# EAGLE schematic CarteMereM1_V2 (EAGLE 8.4.0)

## Sheet 1 of 2
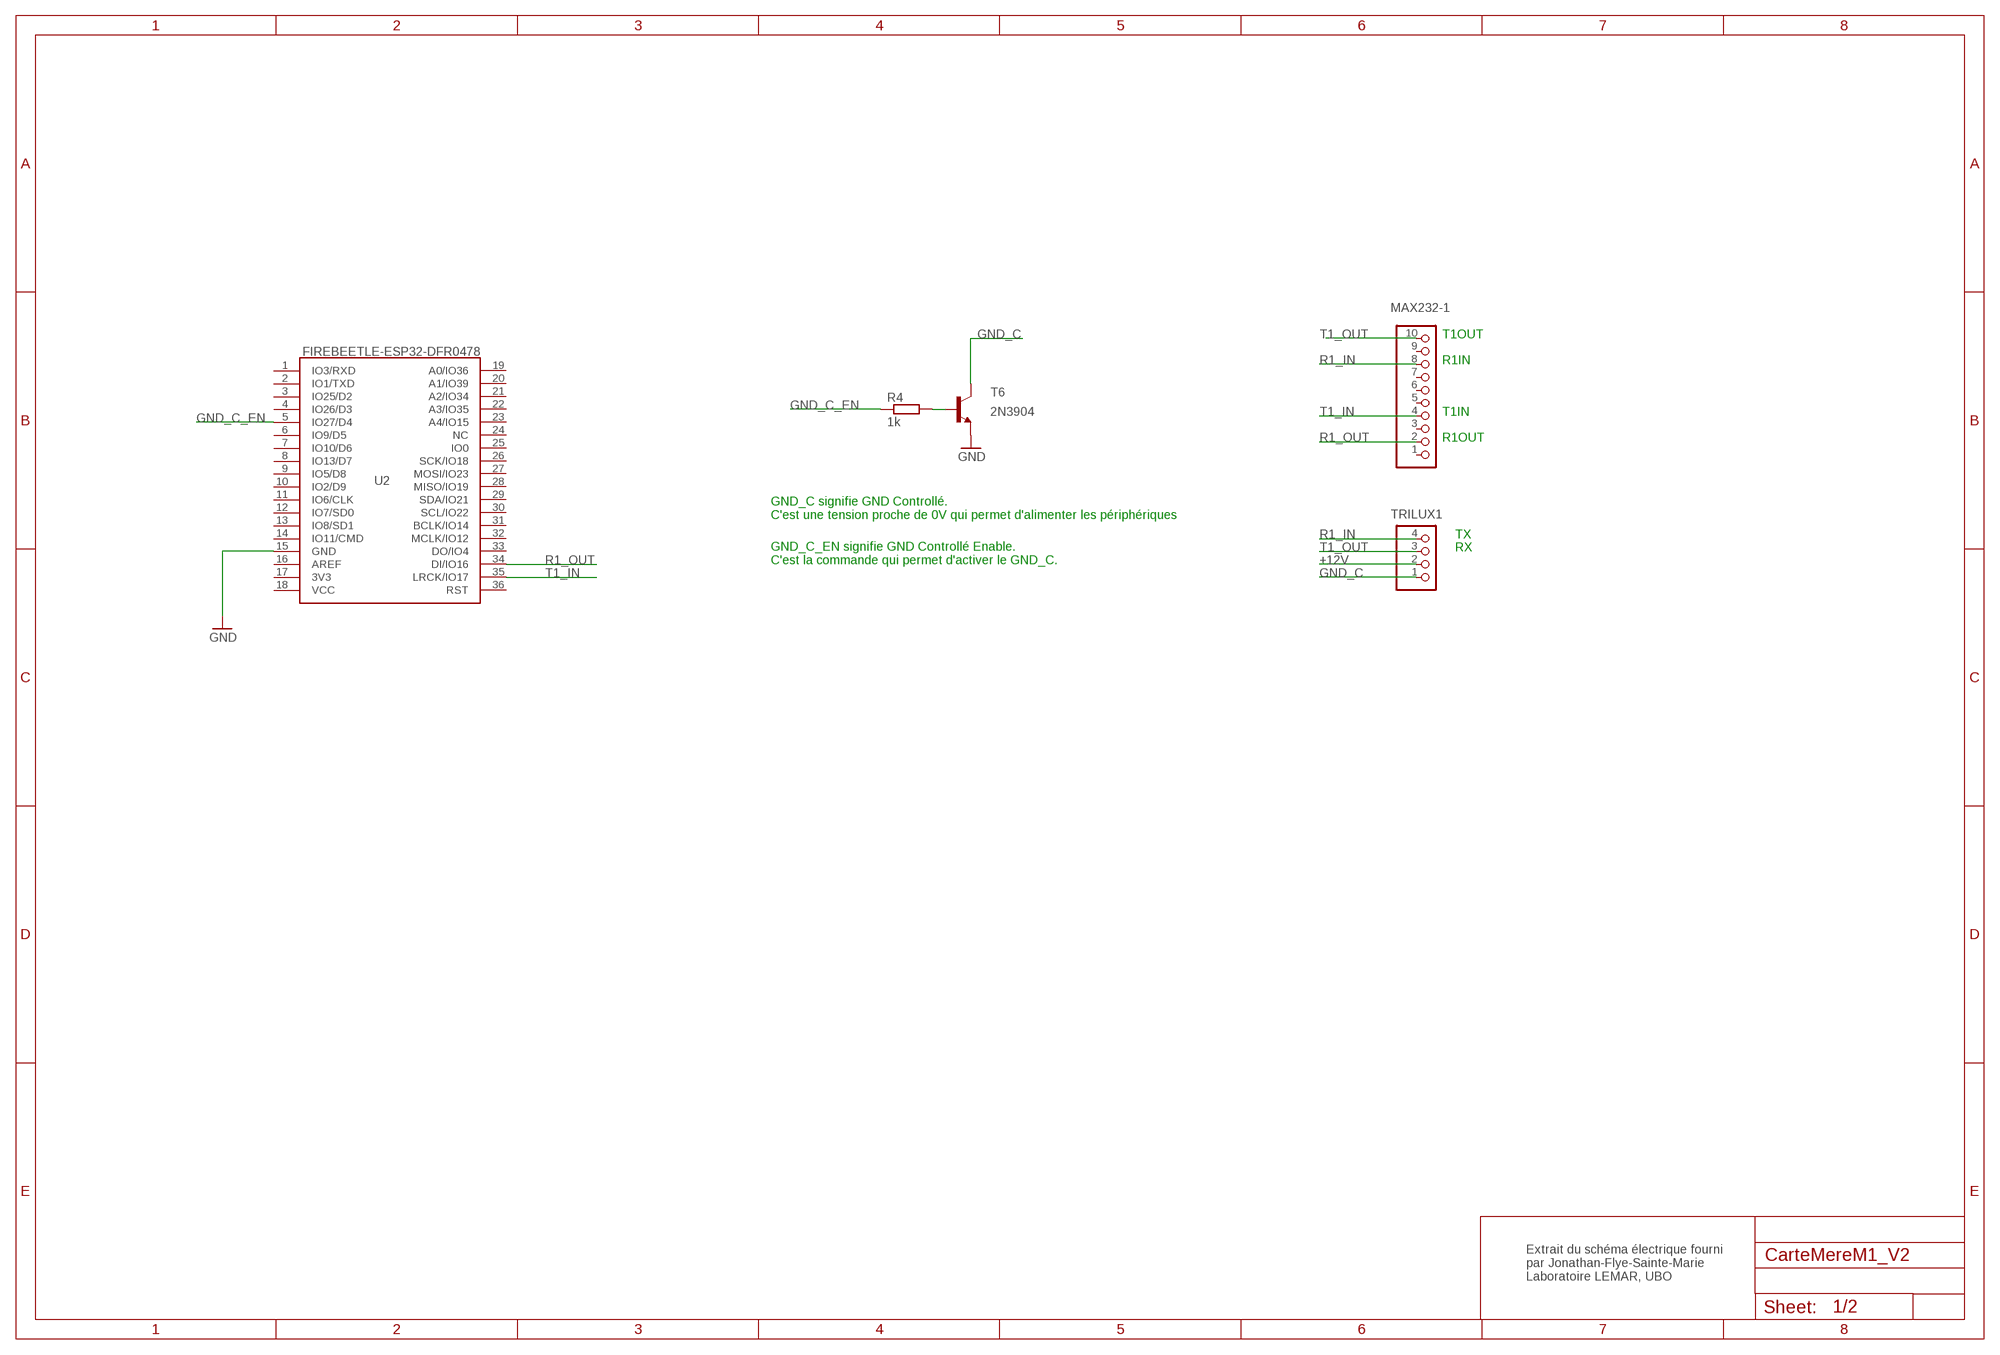
[diagram p0: schematic, sheet 1, part 1 of 2]
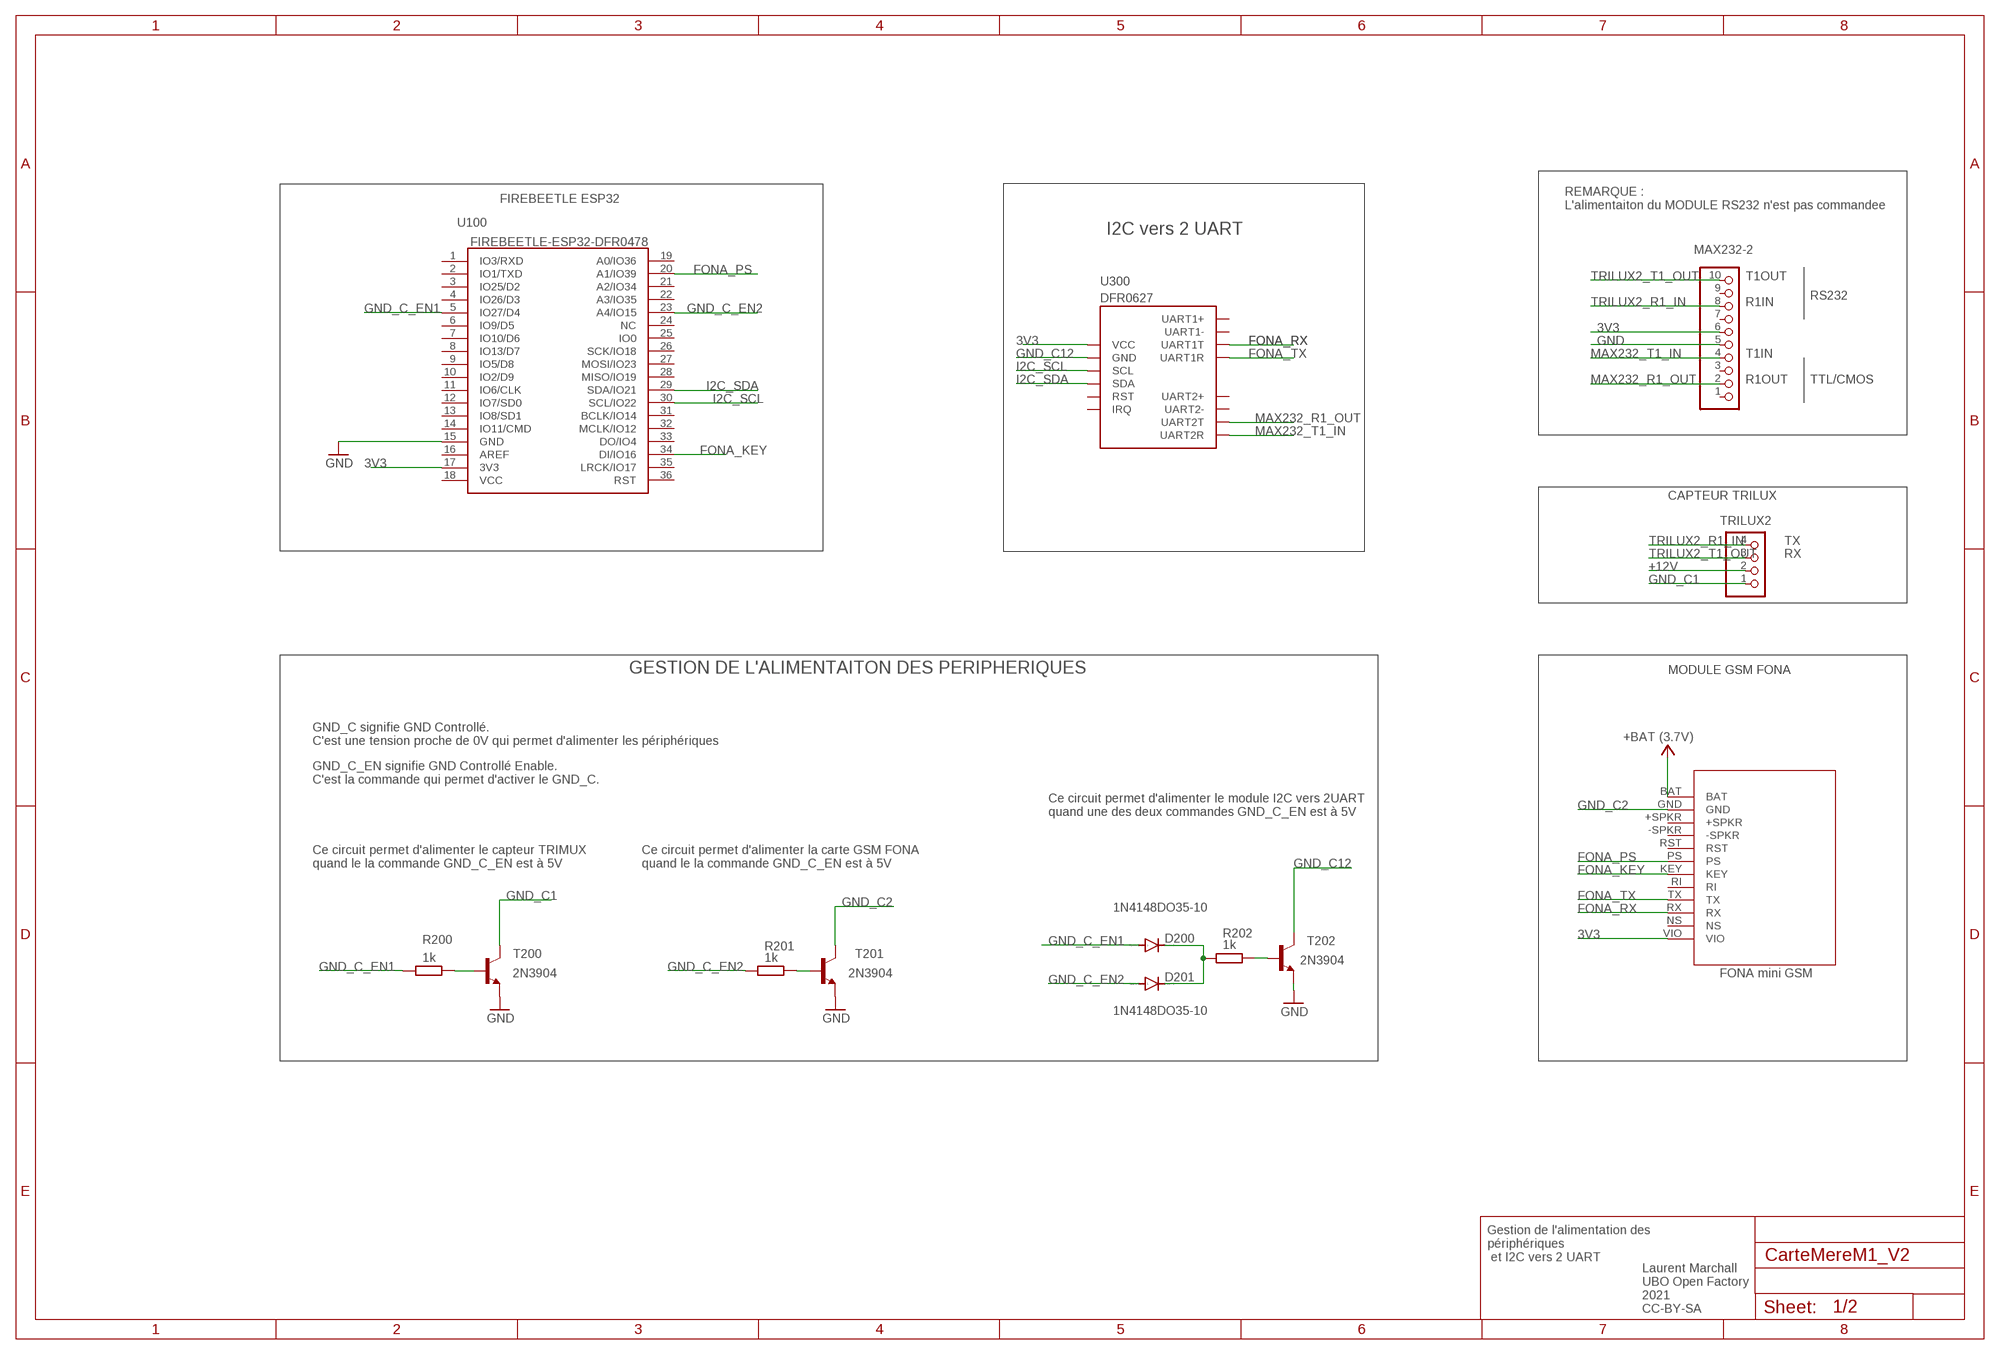
[diagram p1: schematic, sheet 1, part 2 of 2]

### Parts
D200  1N4148DO35-10  [DO35-10]
D201  1N4148DO35-10  [DO35-10]
MAX232-1  PINHD-1X10  [1X10]
MAX232-2  PINHD-1X10  [1X10]
R4  1k  R-EU_0204/7  [0204/7]
R200  1k  R-EU_0204/7  [0204/7]
R201  1k  R-EU_0204/7  [0204/7]
R202  1k  R-EU_0204/7  [0204/7]
T6  2N3904  [TO92]
T200  2N3904  [TO92]
T201  2N3904  [TO92]
T202  2N3904  [TO92]
TRILUX1  PINHD-1X4  [1X04]
TRILUX2  PINHD-1X4  [1X04]
U2  FIREBEETLE-ESP32-DFR0478  [FIREBEETLE_ESP32]
U100  FIREBEETLE-ESP32-DFR0478  [FIREBEETLE_ESP32]
U300  DFR0627  DUAL-UART-MODULE-DFR0627  [DUAL-UART-MODULE-DFR0627]
U$1  FONA_MINI_GSM  [FONA_MINI_GSM]

### Nets
3V3: MAX232-2.6 U100.17(3V3) U300.VCC U$1.VIO
+12V: TRILUX1.2 TRILUX2.2
FONA_KEY: U100.34(DI/IO16) U$1.KEY
FONA_PS: U100.20(A1/IO39) U$1.PS
FONA_RX: U300.UART1T U$1.RX
FONA_TX: U300.UART1R U$1.TX
GND: MAX232-2.5 T6.3(E) T200.3(E) T201.3(E) T202.3(E) U2.15(GND) U100.15(GND)
GND_C: T6.1(C) TRILUX1.1
GND_C1: T200.1(C) TRILUX2.1
GND_C2: T201.1(C) U$1.GND
GND_C12: T202.1(C) U300.GND
GND_C_EN: R4.1 U2.5(IO27/D4)
GND_C_EN1: D200.A R200.1 U100.5(IO27/D4)
GND_C_EN2: D201.A R201.1 U100.23(A4/IO15)
I2C_SCL: U100.30(SCL/IO22) U300.SCL
I2C_SDA: U100.29(SDA/IO21) U300.SDA
MAX232_R1_OUT: MAX232-2.2 U300.UART2T
MAX232_T1_IN: MAX232-2.4 U300.UART2R
N$3: R200.2 T200.2(B)
N$4: R201.2 T201.2(B)
N$5: R202.2 T202.2(B)
N$9: D200.C D201.C R202.1
N$23: R4.2 T6.2(B)
R1_IN: MAX232-1.8 TRILUX1.4
R1_OUT: MAX232-1.2 U2.34(DI/IO16)
T1_IN: MAX232-1.4 U2.35(LRCK/IO17)
T1_OUT: MAX232-1.10 TRILUX1.3
TRILUX2_R1_IN: MAX232-2.8 TRILUX2.4
TRILUX2_T1_OUT: MAX232-2.10 TRILUX2.3
VCC: U$1.BAT ; supply symbol labelled +BAT (3.7V)
Unconnected: MAX232-1.1 MAX232-1.3 MAX232-1.5 MAX232-1.6 MAX232-1.7 MAX232-1.9 MAX232-2.1 MAX232-2.3 MAX232-2.7 MAX232-2.9 U2.1(IO3/RXD) U2.2(IO1/TXD) U2.3(IO25/D2) U2.4(IO26/D3) U2.6(IO9/D5) U2.7(IO10/D6) U2.8(IO13/D7) U2.9(IO5/D8) U2.10(IO2/D9) U2.11(IO6/CLK) U2.12(IO7/SD0) U2.13(IO8/SD1) U2.14(IO11/CMD) U2.16(AREF) U2.17(3V3) U2.18(VCC) U2.19(A0/IO36) U2.20(A1/IO39) U2.21(A2/IO34) U2.22(A3/IO35) U2.23(A4/IO15) U2.24(NC) U2.25(IO0) U2.26(SCK/IO18) U2.27(MOSI/IO23) U2.28(MISO/IO19) U2.29(SDA/IO21) U2.30(SCL/IO22) U2.31(BCLK/IO14) U2.32(MCLK/IO12) U2.33(DO/IO4) U2.36(RST) U100.1(IO3/RXD) U100.2(IO1/TXD) U100.3(IO25/D2) U100.4(IO26/D3) U100.6(IO9/D5) U100.7(IO10/D6) U100.8(IO13/D7) U100.9(IO5/D8) U100.10(IO2/D9) U100.11(IO6/CLK) U100.12(IO7/SD0) U100.13(IO8/SD1) U100.14(IO11/CMD) U100.16(AREF) U100.18(VCC) U100.19(A0/IO36) U100.21(A2/IO34) U100.22(A3/IO35) U100.24(NC) U100.25(IO0) U100.26(SCK/IO18) U100.27(MOSI/IO23) U100.28(MISO/IO19) U100.31(BCLK/IO14) U100.32(MCLK/IO12) U100.33(DO/IO4) U100.35(LRCK/IO17) U100.36(RST) U300.IRQ U300.RST U300.UART1+ U300.UART1- U300.UART2+ U300.UART2- U$1.+SPKR U$1.-SPKR U$1.NS U$1.RI U$1.RST

### Notes on the sheet
- T1OUT
- R1IN
- T1IN
- R1OUT
- GND_C signifie GND Controllé.
  C'est une tension proche de 0V qui permet d'alimenter les périphériques
- TX
- RX
- GND_C_EN signifie GND Controllé Enable.
  C'est la commande qui permet d'activer le GND_C.
- Extrait du schéma électrique fourni 
  par Jonathan-Flye-Sainte-Marie
  Laboratoire LEMAR, UBO
- FIREBEETLE ESP32
- REMARQUE :
  L'alimentaiton du MODULE RS232 n'est pas commandee
- I2C vers 2 UART
- T1OUT
- RS232
- R1IN
- T1IN
- R1OUT | TTL/CMOS
- CAPTEUR TRILUX
- TX
- RX
- GESTION DE L'ALIMENTAITON DES PERIPHERIQUES | MODULE GSM FONA
- GND_C signifie GND Controllé.
  C'est une tension proche de 0V qui permet d'alimenter les périphériques
- GND_C_EN signifie GND Controllé Enable.
  C'est la commande qui permet d'activer le GND_C.
- Ce circuit permet d'alimenter le module I2C vers 2UART
  quand une des deux commandes GND_C_EN est à 5V
- Ce circuit permet d'alimenter le capteur TRIMUX 
  quand le la commande GND_C_EN est à 5V
- Ce circuit permet d'alimenter la carte GSM FONA
  quand le la commande GND_C_EN est à 5V
- Gestion de l'alimentation des 
  périphériques
   et I2C vers 2 UART
- Laurent Marchall
  UBO Open Factory
  2021
  CC-BY-SA

## Sheet 2 of 2

## Library data of the parts
D200 D201 = diode:1N4148: DIODE high speed (Philips)
MAX232-1 MAX232-2 = pinhead:PINHD-1X10: PIN HEADER
R4 R200-R202 = rcl:R-EU_: RESISTOR, European symbol; SPICEPREFIX: R
T6 T200-T202 = transistor:2N3904: NPN TRANSISTOR
TRILUX1 TRILUX2 = pinhead:PINHD-1X4: PIN HEADER
U2 U100 = Eagle_UOF_Lib:FIREBEETLE-ESP32-DFR0478: Development Boards & Kits - Wireless FireBeetle ESP32 IOT MCU Source: Datasheet <https://github.com/Robert-MARKII/Document/blob/master/FireBeetle Board-ESP32 User Manual update.pdf>; DESCRIPTION: Development Boards & Kits - Wireless FireBeetle ESP32 IOT MCU; HEIGHT: mm; MANUFACTURER_NAME: DFRobot; MANUFACTURER_PART_NUMBER: DFR0478; MOUSER_PART_NUMBER: 426-DFR0478; MOUSER_PRICE-STOCK: https://www.mouser.co.uk/ProductDetail/DFRobot/DFR0478?qs=EU6FO9ffTwc%252BR65h2NUGQw%3D%3D
U300 = Eagle_UOF_Lib:DUAL-UART-MODULE-DFR0627: This IIC to Dual UART module offers data transmission rate up to 1Mbps, and each sub UART has independent 256-byte FIFO hardware buffer for transmitting and receiving. The baud rate, word length, and check format of every sub UART can be set independently. The module can provide 2Mbps maximum communication rate. At most four such modules can be connected onto one controller board to expand 8 hardware serial ports. This IIC to dual UART module can be extremely suitable for IoT module, Ultrasonic ranging module and GPS module. There are usually only 1 or 2 UARTs on Controller boards like Arduino, Raspberry Pi, micro:bit, etc. And one of them must be used in program downloading or debugging. When your application needs to connect several UART devices, you may find that there are not enough UARTs on main-board for connecting. Thus, this module could be a perfect solution for the above situation, or you can use this product in IR receiver module and WS2818 RGB relevant projects with strict timing requirements. https://wiki.dfrobot.com/Gravity%3A%20IIC%20to%20Dual%20UART%20Module%20SKU%3A%20DFR0627#target_5
U$1 = FONA_mini_GSM:FONA_MINI_GSM